# EAGLE schematic astable_multivibrator (EAGLE 7.5.0)
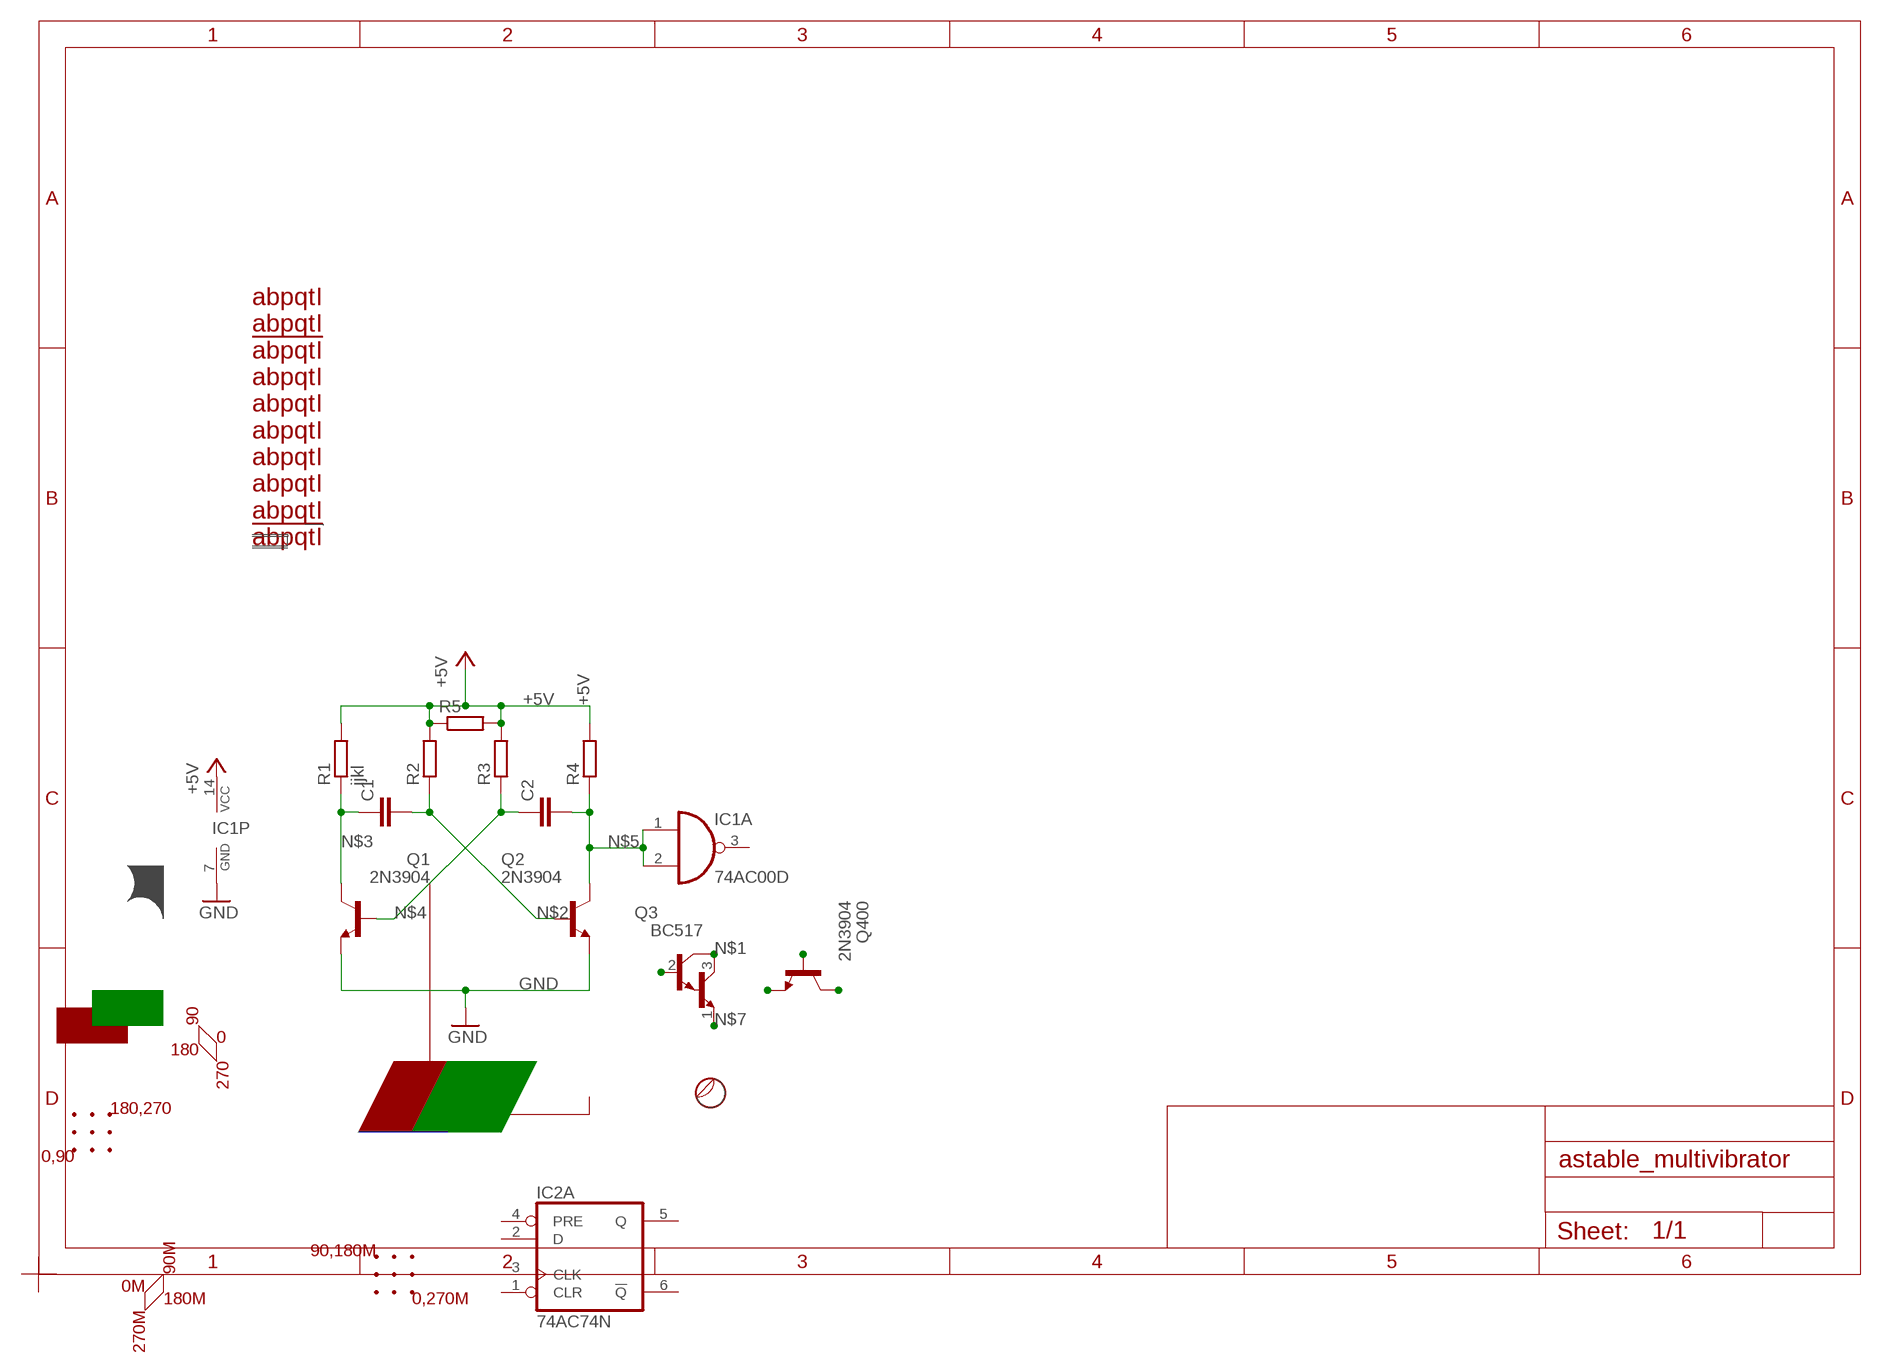
[diagram p0: schematic, sheet 1]

## Parts
C1  C-EU025-024X044  [C025-024X044]
C2  C-EU025-024X044  [C025-024X044]
IC1  74AC00D  [SO14]
IC2  74AC74N  [DIL14]
Q1  2N3904  [TO92]
Q2  2N3904  [TO92]
Q3  BC517  [TO92]
Q400  2N3904  [TO92]
R1  ijkl  R-EU_M2012  [M2012]
R2  R-EU_M2012  [M2012]
R3  R-EU_M2012  [M2012]
R4  R-EU_M2012  [M2012]
R5  R-EU_M2012  [M2012]

## Nets
+5V: IC1.14(P:VCC) R1.2 R2.2 R3.2 R4.2 R5.1 R5.2
GND: IC1.7(P:GND) Q1.3(E) Q2.3(E)
N$1: Q3.3(C)
N$2: C1.2 Q2.2(B) R2.1
N$3: C1.1 Q1.1(C) R1.1
N$4: C2.1 Q1.2(B) R3.1
N$5: C2.2 IC1.1(A:I0) IC1.2(A:I1) Q2.1(C) R4.1
N$6: Q3.2(B)
N$7: Q3.1(E)
N$8: Q400.2(B)
N$9: Q400.3(E)
N$10: Q400.1(C)
Unconnected: IC1.3(A:O) IC1.4(B:I0) IC1.5(B:I1) IC1.6(B:O) IC1.8(C:O) IC1.9(C:I0) IC1.10(C:I1) IC1.11(D:O) IC1.12(D:I0) IC1.13(D:I1) IC2.1(A:CLR) IC2.2(A:D) IC2.3(A:CLK) IC2.4(A:PRE) IC2.5(A:Q) IC2.6(A:!Q) IC2.8(B:!Q) IC2.9(B:Q) IC2.10(B:PRE) IC2.11(B:CLK) IC2.12(B:D) IC2.13(B:CLR)

## Notes on the sheet
- abpqtI
  abpqtI
  !abpqtI
  abpqtI
  abpqtI
  abpqtI
  abpqtI
  abpqtI
  abpqtI
  !abpqtI
- 90
- 180 | 0
- 270
- 180,270
- 0,90
- 90,180M
- 90M
- 0M | 180M | 0,270M
- 270M

## Power pins joined to a net without a drawn wire
GND: IC2.7(P:GND)
VCC: IC2.14(P:VCC)

## Library data of the parts
C1 C2 = rcl:C-EU: CAPACITOR, European symbol
IC1 = 74xx-eu:74*00: Quad 2-input NAND gate
IC2 = 74xx-eu:74*74: Dual D type positive edge triggered FLIP FLOP, preset and clear
Q1 Q2 Q400 = transistor-npn:2N3904: NPN Transistor
Q3 = transistor-npn:BC517*: NPN Darlington Transistor
R1 = rcl:R-EU_: RESISTOR, European symbol; DIGIKEY: 114-5i4-1-ND
R2-R5 = rcl:R-EU_: RESISTOR, European symbol